# Altium schematic sheet ThangMayCNC.SchDoc
size A0
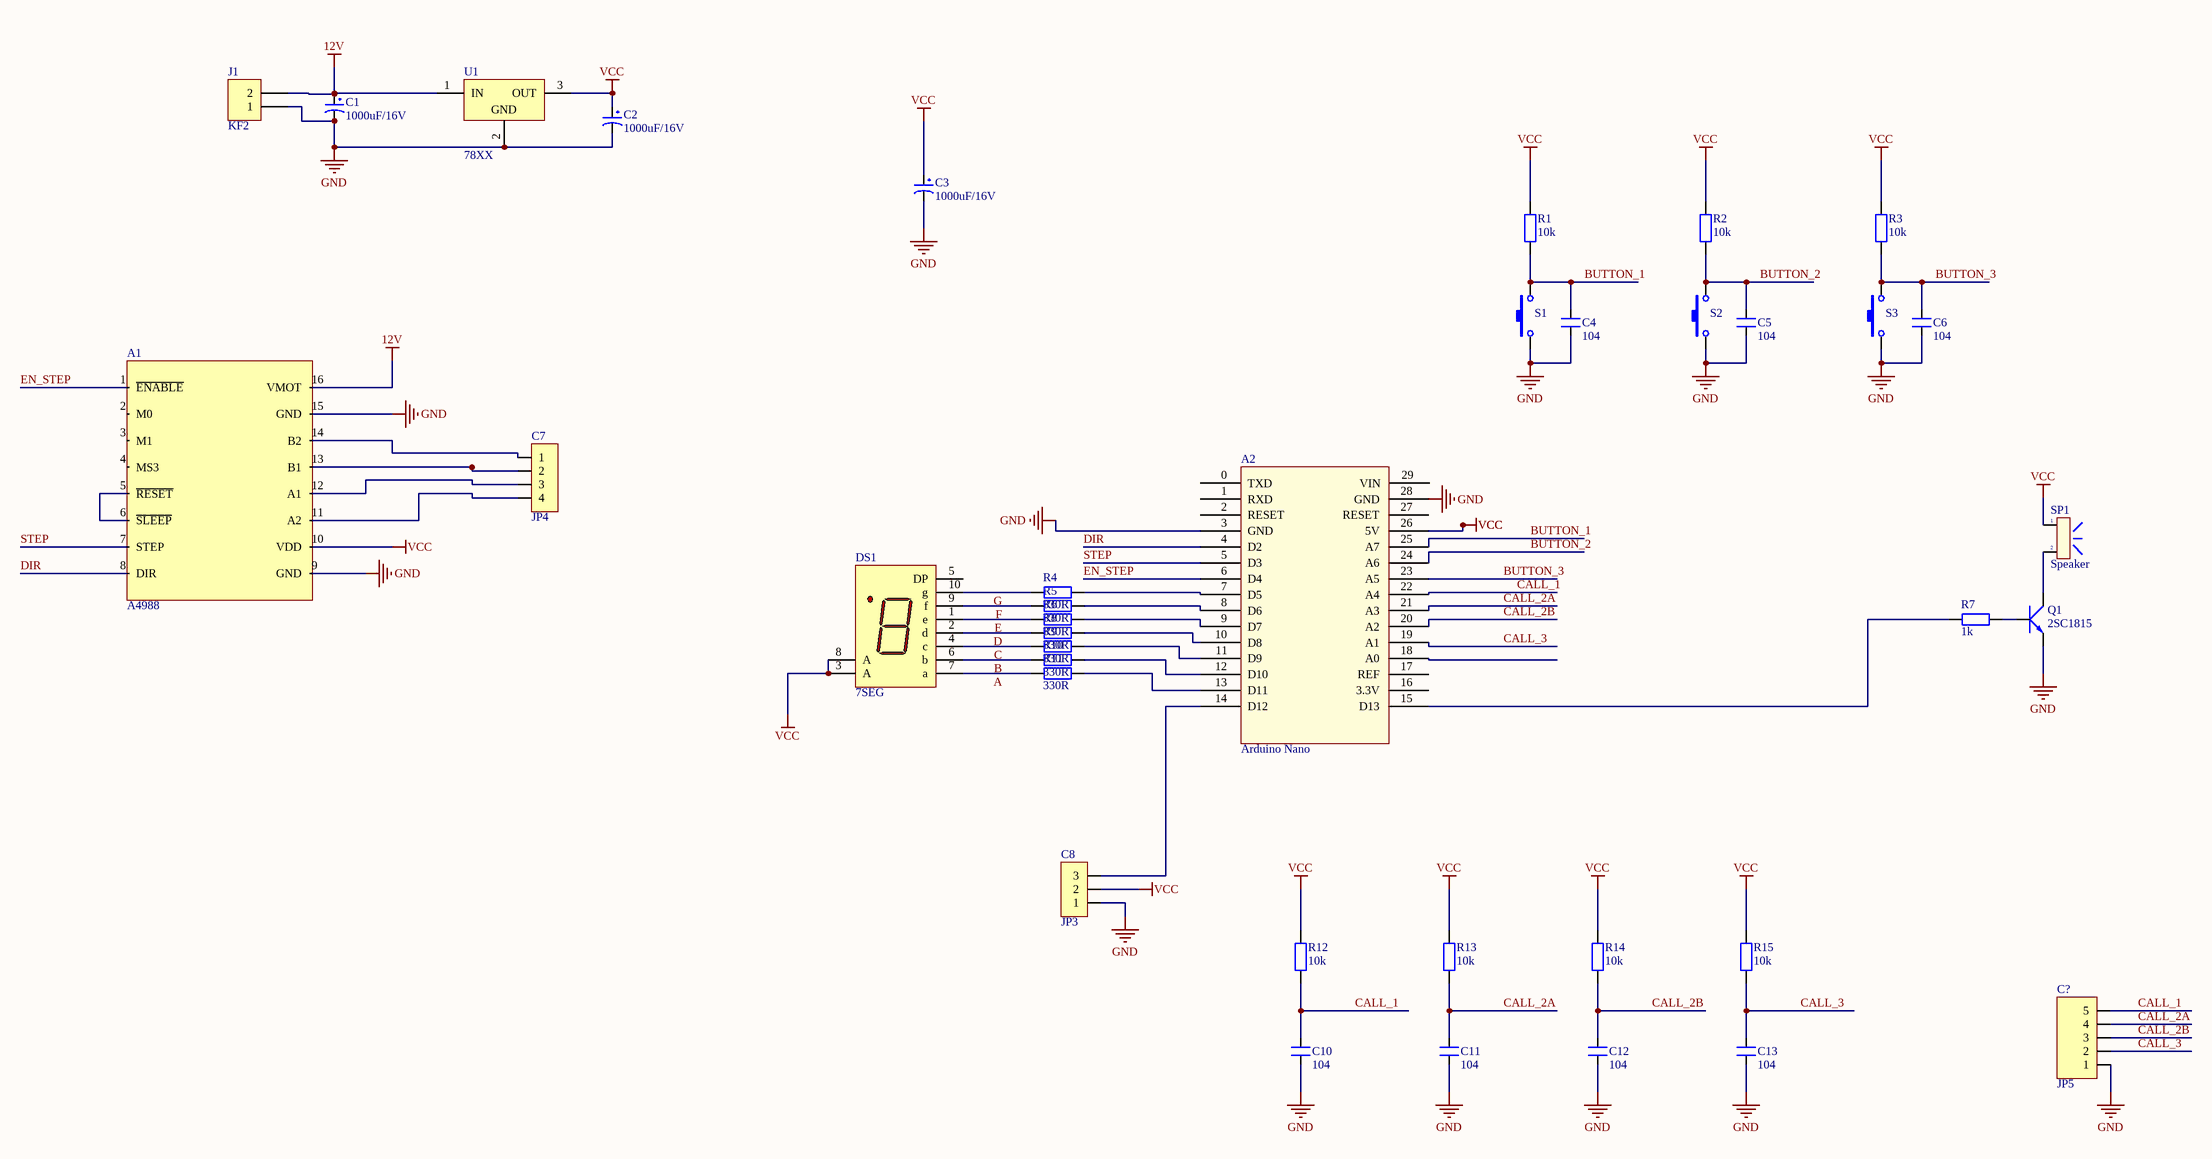
[diagram p0: ThangMayCNC.SchDoc]

## Parts
A1  A4988  [A4988]
A2  Arduino Nano  [Arduino Nano]
C1  1000uF/16V  [CP1.5/3.4]
C2  1000uF/16V  [CP1.5/3.4]
C3  1000uF/16V  [CP1.5/3.4]
C4  104  [SM-0805]
C5  104  [SM-0805]
C6  104  [SM-0805]
C7  JP4  [KF3-5.08]
C8  JP3  [JP3-D1T]
C10  104  [SM-0805]
C11  104  [SM-0805]
C12  104  [SM-0805]
C13  104  [SM-0805]
C?  JP5  [JP5-C1T]
DS1  7SEG  [LED 7 SEG 1 DIGIT]
J1  KF2  [KF2-5.08]
Q1  2SC1815  [TO92-123]
R1  10k  [RES-SMD-0805]
R2  10k  [RES-SMD-0805]
R3  10k  [RES-SMD-0805]
R4  330R  [RES-SMD-0805]
R5  330R  [RES-SMD-0805]
R6  330R  [RES-SMD-0805]
R7  1k  [RES-SMD-0805]
R8  330R  [RES-SMD-0805]
R9  330R  [RES-SMD-0805]
R10  330R  [RES-SMD-0805]
R11  330R  [RES-SMD-0805]
R12  10k  [RES-SMD-0805]
R13  10k  [RES-SMD-0805]
R14  10k  [RES-SMD-0805]
R15  10k  [RES-SMD-0805]
S1  SW  [BUTTON  ROUND]  (value not drawn)
S2  SW  [BUTTON  ROUND]  (value not drawn)
S3  SW  [BUTTON  ROUND]  (value not drawn)
SP1  Speaker  [SPK]
U1  78XX  [TO252-123]

## Nets
12V: A1.16(VMOT) C1.1 J1.2 U1.1(IN)
GND: A1.9(GND) A1.15(GND) A2.3(GND) A2.28(GND) C1.2 C2.2 C3.2 C4.1 C5.1 C6.1 C8.1 C10.1 C11.1 C12.1 C13.1 C?.1 J1.1 Q1.1(E) S1.1 S2.1 S3.1 U1.2(GND)
VCC: A1.10(VDD) A2.26(5V) C2.1 C3.1 C8.2 DS1.3(A) DS1.8(A) R1.2 R2.2 R3.2 R12.2 R13.2 R14.2 R15.2 SP1.1 U1.3(OUT)
A: DS1.7(a) R11.2
B: DS1.6(b) R10.2
BUTTON_1: A2.25(A7) C4.2 R1.1 S1.2
BUTTON_2: A2.24(A6) C5.2 R2.1 S2.2
BUTTON_3: A2.23(A5) C6.2 R3.1 S3.2
C: DS1.4(c) R9.2
CALL_1: A2.22(A4) C10.2 C?.5 R12.1
CALL_2A: A2.21(A3) C11.2 C?.4 R13.1
CALL_2B: A2.20(A2) C12.2 C?.3 R14.1
CALL_3: A2.19(A1) C13.2 C?.2 R15.1
D: DS1.2(d) R8.2
DIR: A1.8(DIR) A2.4(D2)
E: DS1.1(e) R6.2
EN_STEP: A1.1(~{ENABLE}) A2.6(D4)
F: DS1.9(f) R5.2
G: DS1.10(g) R4.2
STEP: A1.7(STEP) A2.5(D3)
NetA1_5: A1.5(~{RESET}) A1.6(~{SLEEP})
NetA1_11: A1.11(A2) C7.4
NetA1_12: A1.12(A1) C7.3
NetA1_13: A1.13(B1) C7.2
NetA1_14: A1.14(B2) C7.1
NetA2_7: A2.7(D5) R4.1
NetA2_8: A2.8(D6) R5.1
NetA2_9: A2.9(D7) R6.1
NetA2_10: A2.10(D8) R8.1
NetA2_11: A2.11(D9) R9.1
NetA2_12: A2.12(D10) R10.1
NetA2_13: A2.13(D11) R11.1
NetA2_14: A2.14(D12) C8.3
NetA2_15: A2.15(D13) R7.2
NetQ1_2: Q1.2(C) SP1.2
NetQ1_3: Q1.3(B) R7.1

Not connected (* = marked no-connect by the designer): A1 2(M0) 3(M1) 4(MS3); A2 0(TXD) 1(RXD) 2(RESET) 16(3.3V) 17(REF) 18(A0) 27(RESET) 29(VIN); DS1 5(DP)

## Library data of the parts
C1-C3 = CP4: Cap 1000uF/16V - 220uF/50V; Description 5: 4,7uF>10uF/250V_3,3uF>10uF/400V - 2,2uF>4,7uF/450V; Description 1: 2200uF-3300uF/6,3V - 1000uF-2200uF/10V; Description 2: 1000uF/16V - 470uF => 1000uF/25V - 100uF/100V; Description 3: 330uF>470uF/35V_220uF>470uF/50V_10uF>22uF/250V; Description 4: 220uF => 330uF/63V - 10uF =>33uF/160 - 200V; Value: 1000uF/16V
C4-C6 C10-C13 = CM: Cap SMD; Value: 103
C7 = JP4: WR-PHD 2.54 mm Angled Socket Header; Manufacturer: W¨¹rth Elektronik eiSos GmbH; partNo: 613004143121; ComponentLink1 Description: Manufacturer; ComponentLink2 Description: Datasheet; NoPins: 04; Created Date: 29 March 2013; ComponentLink1URL: http://www.we-online.com; ComponentLink2URL: http://katalog.we-online.de/em/datasheet/6130xx143121.pdf; Created by: Karrer Zheng
C8 = JP3: WR-PHD 2.54 mm Angled Socket Header; Manufacturer: W¨¹rth Elektronik eiSos GmbH; partNo: 613003143121; ComponentLink1 Description: Manufacturer; ComponentLink2 Description: Datasheet; NoPins: 03; Created Date: 29 March 2013; ComponentLink1URL: http://www.we-online.com; ComponentLink2URL: http://katalog.we-online.de/em/datasheet/6130xx143121.pdf; Created by: Karrer Zheng
C? = JP5: WR-PHD 2.54 mm Angled Socket Header; Manufacturer: W¨¹rth Elektronik eiSos GmbH; partNo: 613005143121; ComponentLink1 Description: Manufacturer; ComponentLink2 Description: Datasheet; NoPins: 05; Created Date: 29 March 2013; ComponentLink1URL: http://www.we-online.com; ComponentLink2URL: http://katalog.we-online.de/em/datasheet/6130xx143121.pdf; Created by: Karrer Zheng
DS1 = LED 7 SEG 1 DIGIT: HDSP-315E
J1 = KF2: Manufacturer: Würth Elektronik eiSos GmbH; partNo: 691103110002; ComponentLink1 Description: Manufacturer; ComponentLink2 Description: Datasheet; NoPins: 2; Created Date: 29 October 2013; ComponentLink1URL: http://www.we-online.com; ComponentLink2URL: http://katalog.we-online.de/em/datasheet/6911031100xx.pdf; Created by: Karrer Zheng
Q1 = 2SC1815: NPN 600mW, ECB; Value: C1815
R1-R15 = R: Resistor R1/4W
S1-S3 = SW-Button: Switch-Button; Published: 24-Mar-1999; LatestRevisionDate: 17-Jul-2002; LatestRevisionNote: Re-released for DXP Platform.; PackageReference: SPST-2; Publisher: Altium Limited
SP1 = SPK: Speaker Chip; Value: Speaker Chip
U1 = LM78XX